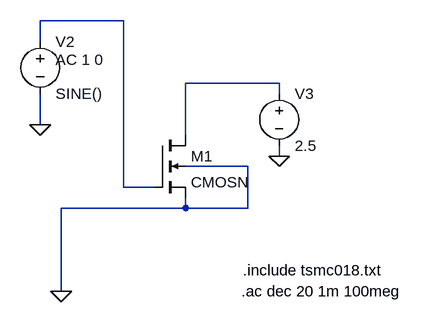
[diagram p0: schematic BaiTap1.2.asc]
BaiTap1.2.asc, the LTspice schematic file:
Version 4
SHEET 1 880 680
WIRE -112 -160 -240 -160
WIRE -240 -128 -240 -160
WIRE 128 -64 -16 -64
WIRE 128 -48 128 -64
WIRE -240 0 -240 -48
WIRE -16 16 -16 -64
WIRE 128 48 128 32
WIRE 80 64 -16 64
WIRE -112 96 -112 -160
WIRE -64 96 -112 96
WIRE -16 128 -16 112
WIRE -16 128 -208 128
WIRE 80 128 80 64
WIRE 80 128 -16 128
WIRE -208 256 -208 128
FLAG -208 256 0
FLAG -240 0 0
FLAG 128 48 0
SYMBOL voltage -240 -144 R0
WINDOW 123 24 44 Left 2
WINDOW 39 0 0 Left 0
SYMATTR Value2 AC 1 0
SYMATTR InstName V2
SYMATTR Value SINE()
SYMBOL voltage 128 -64 R0
WINDOW 123 0 0 Left 0
WINDOW 39 0 0 Left 0
SYMATTR InstName V3
SYMATTR Value 2.5
SYMBOL nmos4 -64 16 R0
SYMATTR InstName M1
SYMATTR Value CMOSN
SYMATTR Value2 l=180n w=1u
TEXT 72 224 Left 2 !.include tsmc018.txt
TEXT 70 256 Left 2 !.ac dec 20 1m 100meg

The netlist it stands for:
* BaiTap1.2.asc
V2 N001 0 SINE() AC 1 0
V3 N002 0 2.5
M1 N002 N001 0 0 CMOSN l=180n w=1u
.model NMOS NMOS
.model PMOS PMOS
.lib standard.mos
.include tsmc018.txt
.ac dec 20 1m 100meg
.backanno
.end